# Altium schematic sheet driver_V1.1.SchDoc
size A4
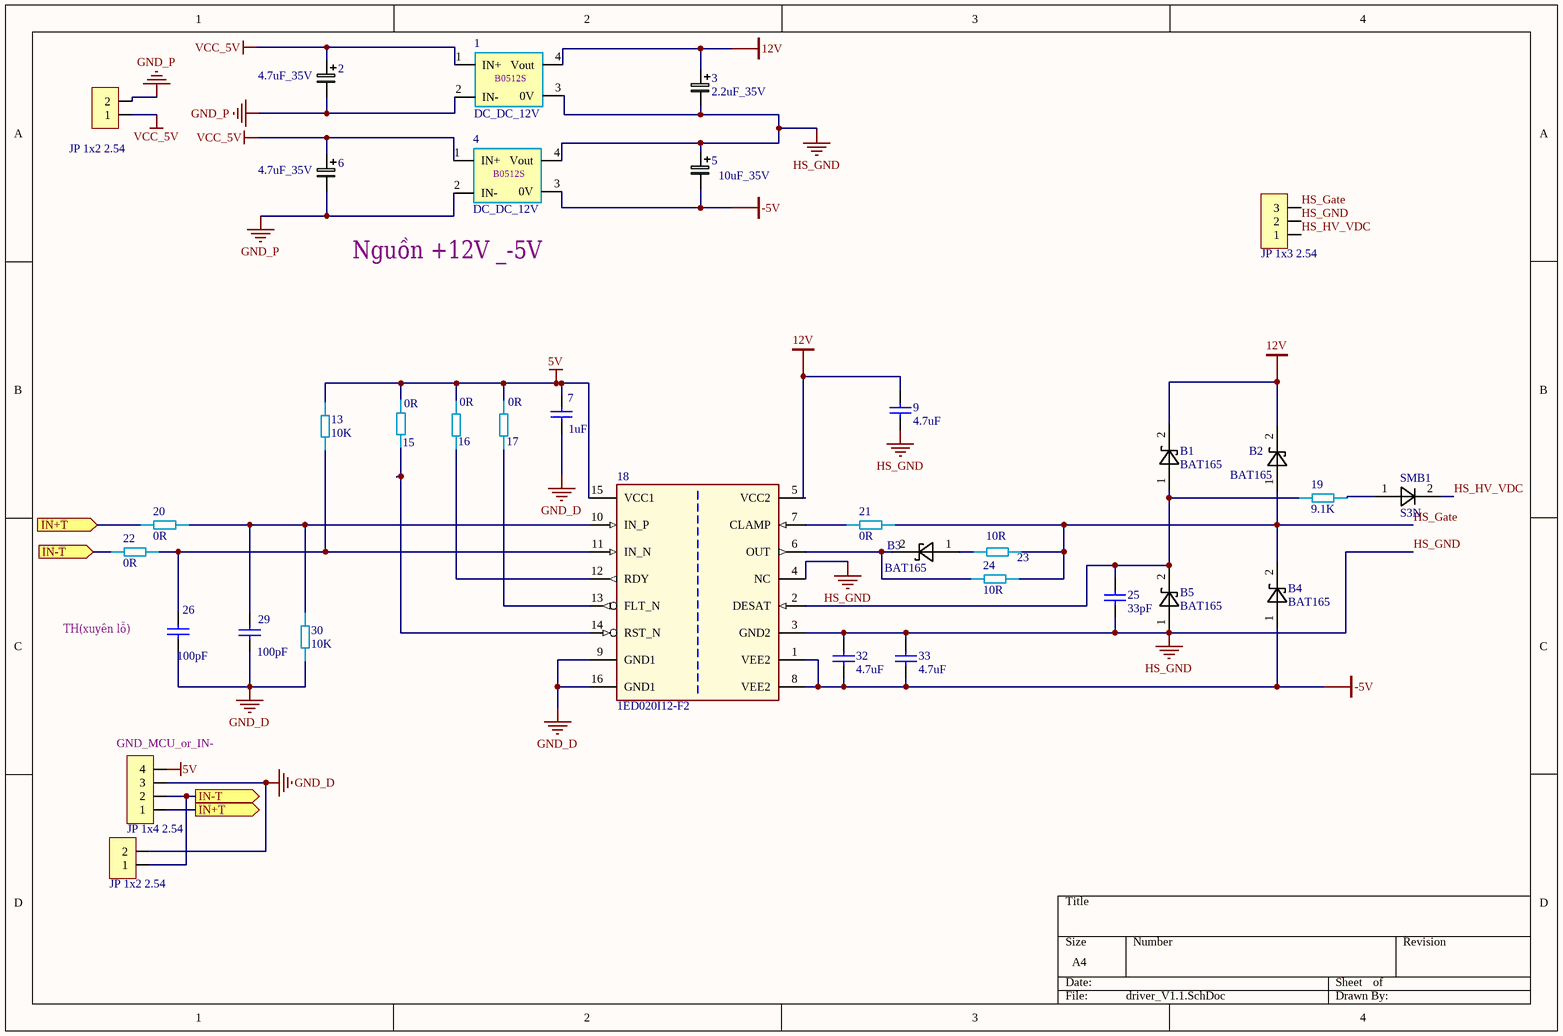
[diagram p0: driver_V1.1.SchDoc]

## Parts
1  DC_DC_12V  [B0512S/D-1W]
2  4.7uF_35V  [tu_4x5.4mm]
3  2.2uF_35V  [tu_4x5.4mm]
4  DC_DC_12V  [B0512S/D-1W]
5  10uF_35V  [tu_4x5.4mm]
6  4.7uF_35V  [tu_4x5.4mm]
7  1uF  [Tu 0805_N]
9  4.7uF  [tu 1206_N]
13  10K  [RES1206]
15  0R  [RES1206]
16  0R  [RES1206]
17  0R  [RES1206]
18  1ED020I12-F2  [SOIC127P1028X264-16N-1]
19  9.1K  [RES_2512]
20  0R  [RES1206]
21  0R  [RES_2512]
22  0R  [RES1206]
23  10R  [RES_2512]
24  10R  [RES_2512]
25  33pF  [Tu 0805_N]
26  100pF  [Tu 0603]
29  100pF  [Tu 0603]
30  10K  [RES1206]
32  4.7uF  [tu 1206_N]
33  4.7uF  [tu 1206_N]
34  JP 1x2 2.54  [JP 1x2 DT_n]
B1  BAT165  [BAT165E6327HTSA1TRND]
B2  BAT165  [BAT165E6327HTSA1TRND]
B3  BAT165  [BAT165E6327HTSA1TRND]
B4  BAT165  [BAT165E6327HTSA1TRND]
B5  BAT165  [BAT165E6327HTSA1TRND]
IN+1  JP 1x4 2.54  [JP 1X4 DT_N]
JP1  JP 1x2 2.54  [JP 1x2 DT_n]
JP?  JP 1x3 2.54  [JP 1x3 DT]
SMB1  S3N  [SMB]

## Ports
IN+T (in), IN+T (out), IN-T (in), IN-T (out)

## Nets
5V: 7.2 13.2 15.2 16.1 17.2 18.15(VCC1) IN+1.4
12V: 1.4(Vout) 3.1 9.2 18.5(VCC2) B1.2 B2.2
-5V: 4.3(0V) 5.2 18.1(VEE2) 18.8(VEE2) 32.1 33.1 B4.1
GND_D: 7.1 18.9(GND1) 18.16(GND1) 26.1 29.1 30.1 34.2 IN+1.3
GND_P: 1.2(IN-) 2.2 4.2(IN-) 6.2 JP1.2
HS_GND: 1.3(0V) 3.2 4.4(Vout) 5.1 9.1 18.3(GND2) 18.4(NC) 25.1 32.2 33.2 B5.1 JP?.2
VCC_5V: 1.1(IN+) 2.1 4.1(IN+) 6.1 JP1.1
HS_Gate: 21.2 23.2 24.2 B2.1 B4.2 JP?.3
HS_HV_VDC: JP?.1 SMB1.2
IN+T: 20.1 IN+1.1 ; port IN+T
IN-T: 22.1 34.1 IN+1.2 ; port IN-T
Net13_1: 13.1 18.11(IN_N) 22.2 26.2
Net15_1: 15.1 18.14(RST_N)
Net16_2: 16.2 18.12(RDY)
Net17_1: 17.1 18.13(FLT_N)
Net18_2: 18.2(DESAT) 19.1 25.2 B1.1 B5.2
Net18_6: 18.6(OUT) 24.1 B3.2
Net18_7: 18.7(CLAMP) 21.1
Net18_10: 18.10(IN_P) 20.2 29.2 30.2
Net19_2: 19.2 SMB1.1
Net23_1: 23.1 B3.1

## Notes on the sheet
- Nguồn +12V _-5V
- (near 26) TH(xuyên lỗ)
- (near IN+1) GND_MCU_or_IN-
- (in symbol DC_DC_12v) B0512S

## Library data of the parts
2 3 5 6 = capacitor_electric
7 25 = cap_0805
9 32 33 = cap_1210
13 15-17 19-24 30 = 311-0.0GRTR-ND
18 = 1ED020I12-F2: Single IGBT Driver IC; Manufacturer: Infineon Technologies; Manufacturer Order Number: 1ED020I12-F2; PackageReference: PG-DSO-16-15
26 29 = cap_0603
34 JP1 = JP 1x2 2.54 Duc Thang: Cắm; Ten_Linh_Kien: Jump Đơn Đực 2.54MM 1x40P Thẳng 11MM; Don_Vi: Con; Ma_Hang: MH000903; Ghi_Chu: *; Kieu_Chan: *; Chung_Loai: Cắm
IN+1 = JP 1x4 2.54 Duc Thang: Cắm; Ten_Linh_Kien: Jump Đơn Đực 2.54MM 1x40P Thẳng 11MM; Don_Vi: Con; Ma_Hang: MH000903; Ghi_Chu: *; Kieu_Chan: *; Chung_Loai: Cắm
JP? = JP 1x3 2.54 Duc Cong: Cắm; Ten_Linh_Kien: Jump Đơn Đực 2.54MM 1x40P Cong Đứng; Don_Vi: Con; Ma_Hang: MH000904; Ghi_Chu: *; Kieu_Chan: *; Chung_Loai: Cắm
SMB1 = S3A-S3N